# EAGLE design RatDBS-Plastic2032Battery-WithRegulator (EAGLE 7.7.0)
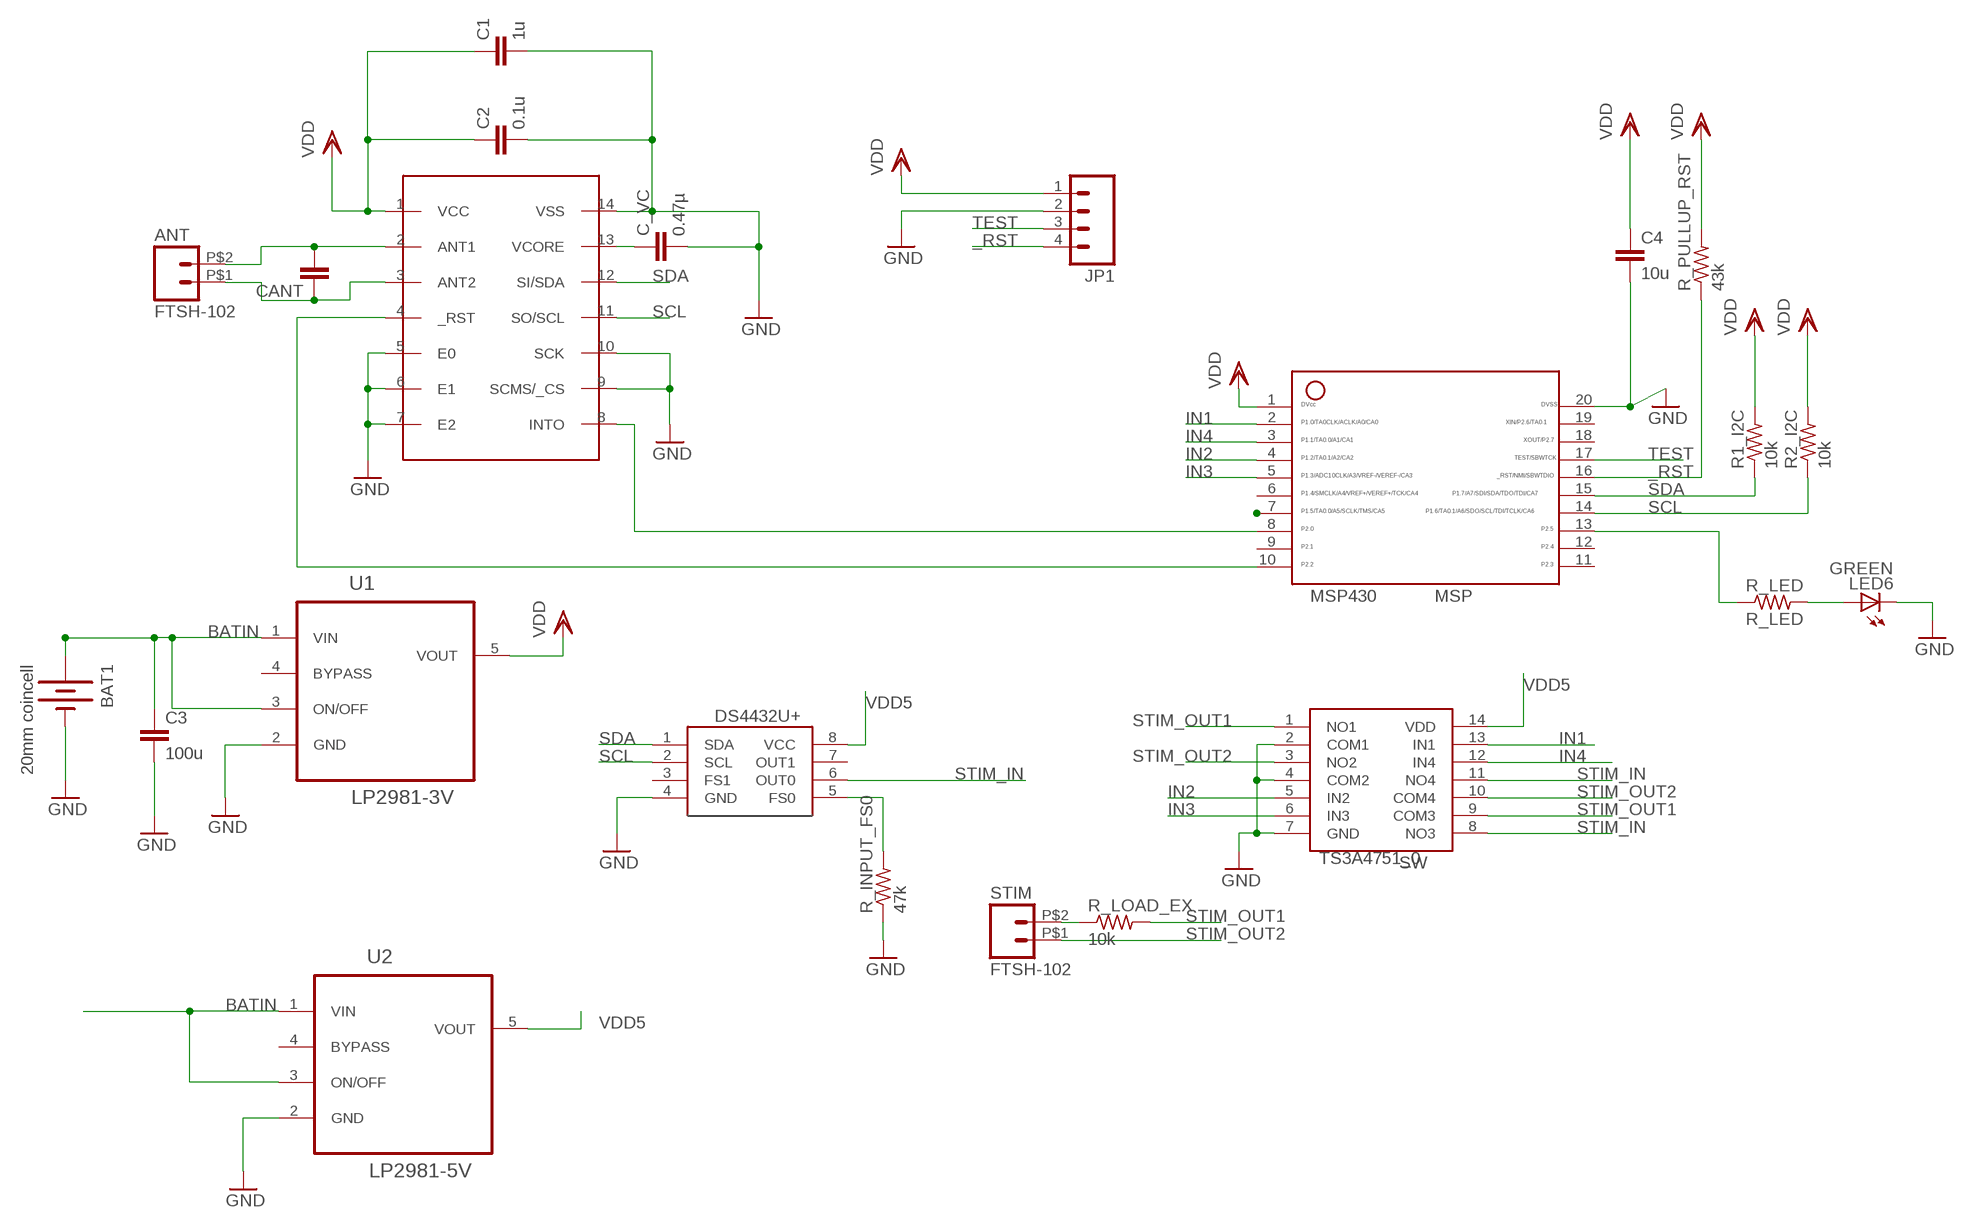
[diagram p0: schematic, sheet 1]

## Parts
ANT  FTSH-102  [FTSH-102-DH]
BAT1  20mm coincell  BATTERY  [BATTCOM_20MM_PLASTIC_STUDS]
C1  1u  C-EUC0603  [C0603]
C2  0.1u  C-EUC0603  [C0603]
C3  100u  C-EUC1206  [C1206]
C4  10u  C-EUC1206  [C1206]
C_VC  0.47µ  C-EUC0603  [C0603]
CANT  C-EUC0603  [C0603]
DS4432U+  DS4432U+  [8_PIN]
JP1  M041.27MM  [1X04-1.27MM]
LED6  GREEN  LED1206  [LED-1206]
MSP430  MSP  MSP430  [20_PIN]
R1_I2C  10k  R-US_R0603  [R0603]
R2_I2C  10k  R-US_R0603  [R0603]
R_INPUT_FS0  47k  R-US_R0603  [R0603]
R_LED  R_LED  R-US_R0603  [R0603]
R_LOAD_EX  10k  R-US_R0603  [R0603]
R_PULLUP_RST  43k  R-US_R0603  [R0603]
STIM  FTSH-102  [FTSH-102-DH]
TS3A4751_0  SW  TS3A4751  [14_PIN]
U1  LP2981-3V  LP2985A-33DBVTE4  [SOT95P280X145-5N]
U2  LP2981-5V  LP2985A-33DBVTE4  [SOT95P280X145-5N]
U$1  RF  RF430CL330H  [PW_R-PDSO-G14]

## Nets
_RST: JP1.4 MSP430.16 R_PULLUP_RST.1
BATIN: BAT1.1(+) C3.1 U1.1(VIN) U1.3(ON/OFF) U2.1(VIN) U2.3(ON/OFF)
GND: BAT1.2(-) C1.2 C2.2 C3.2 C4.2 C_VC.2 DS4432U+.4(GND) JP1.2 LED6.C MSP430.20 R_INPUT_FS0.1 TS3A4751_0.2(COM1) TS3A4751_0.4(COM2) TS3A4751_0.7(GND) U1.2(GND) U2.2(GND) U$1.5(E0) U$1.6(E1) U$1.7(E2) U$1.9(SCMS/_CS) U$1.10(SCK) U$1.14(VSS)
IN1: MSP430.2 TS3A4751_0.13(IN1)
IN2: MSP430.4 TS3A4751_0.5(IN2)
IN3: MSP430.5 TS3A4751_0.6(IN3)
IN4: MSP430.3 TS3A4751_0.12(IN4)
N$1: C_VC.1 U$1.13(VCORE)
N$2: ANT.P$2 CANT.2 U$1.2(ANT1)
N$3: MSP430.8 U$1.8(INTO)
N$4: R_LOAD_EX.1 STIM.P$2
N$5: MSP430.13 R_LED.1
N$6: MSP430.7
N$7: MSP430.10 U$1.4(_RST)
N$8: DS4432U+.5(FS0) R_INPUT_FS0.2
N$9: LED6.A R_LED.2
N$12: ANT.P$1 CANT.1 U$1.3(ANT2)
SCL: DS4432U+.2(SCL) MSP430.14 R2_I2C.1 U$1.11(SO/SCL)
SDA: DS4432U+.1(SDA) MSP430.15 R1_I2C.1 U$1.12(SI/SDA)
STIM_IN: DS4432U+.6(OUT0) TS3A4751_0.8(NO3) TS3A4751_0.11(NO4)
STIM_OUT1: R_LOAD_EX.2 TS3A4751_0.1(NO1) TS3A4751_0.9(COM3)
STIM_OUT2: STIM.P$1 TS3A4751_0.3(NO2) TS3A4751_0.10(COM4)
TEST: JP1.3 MSP430.17
VDD: C1.1 C2.1 C4.1 JP1.1 MSP430.1 R1_I2C.2 R2_I2C.2 R_PULLUP_RST.2 U1.5(VOUT) U$1.1(VCC)
VDD5: DS4432U+.8(VCC) TS3A4751_0.14(VDD) U2.5(VOUT)
Unconnected: DS4432U+.3(FS1) DS4432U+.7(OUT1) MSP430.6 MSP430.9 MSP430.11 MSP430.12 MSP430.18 MSP430.19 U1.4(BYPASS) U2.4(BYPASS)

## Library data of the parts
ANT STIM = Samtec50Mil:FTSH-102
BAT1 = Battery:BATTERY: Compact CR2032 Battery Holder SMT ground pad 20MM_4LEGS, Digikey: BAT-HLD-001-THM-OTL
C1-C4 C_VC CANT = rcl:C-EU: CAPACITOR, European symbol
DS4432U+ = RatDBS:DS4432U+: DS4432U+ current DAC
JP1 = SparkFun:M04: Header 4 Standard 4-pin 0.1" header. Use with straight break away headers (SKU : PRT-00116), right angle break away headers (PRT-00553), swiss pins (PRT-00743), machine pins (PRT-00117), and female headers (PRT-00115). Molex polarized connector foot print use with SKU : PRT-08231 with associated crimp pins and housings.
LED6 = SparkFun-LED:LED: LEDs Standard schematic elements and footprints for 5mm, 3mm, 1206, and 0603 sized LEDs. 5mm - Spark Fun Electronics SKU : COM-00529 (and others)
MSP430 = RatDBS:MSP430: MSP430 20 pins
R1_I2C R2_I2C R_INPUT_FS0 R_LED R_LOAD_EX R_PULLUP_RST = BiphasicBoard:R-US_: RESISTOR, American symbol
TS3A4751_0 = BiphasicBoard:TS3A4751: TS3A4751 Quad Switch
U1 U2 = Texas Instruments_By_element14_Batch_1:LP2985A-33DBVTE4: 150-mA LOW-NOISE LOW-DROPOUT REGULATOR WITH SHUTDOWN; MPN: LP2985A-33DBVTE4; OC_FARNELL: 1053660; OC_NEWARK: 79K3928; PACKAGE: SOT-23-5; SUPPLIER: Texas Instruments
U$1 = RF430CL330H:RF430CL330H

## Board
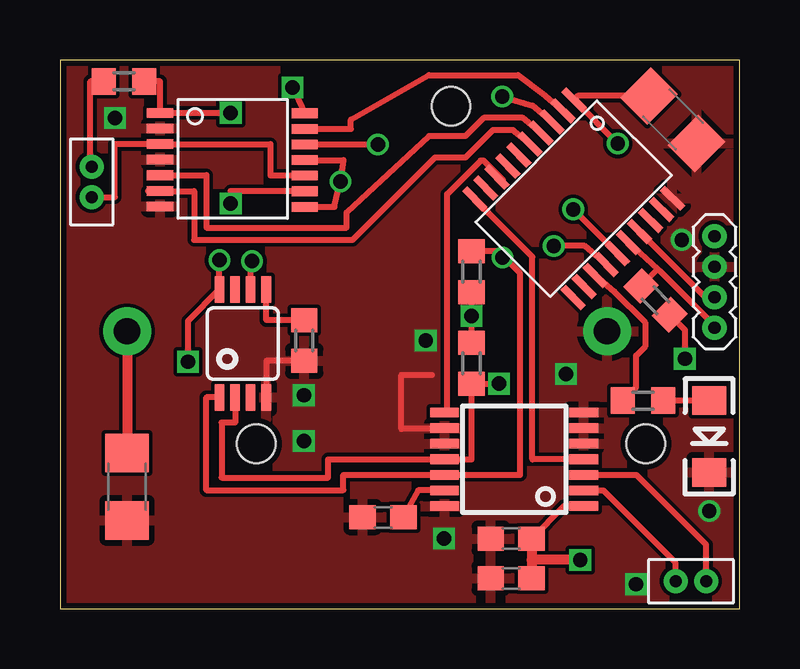
[diagram p1: board, top side]
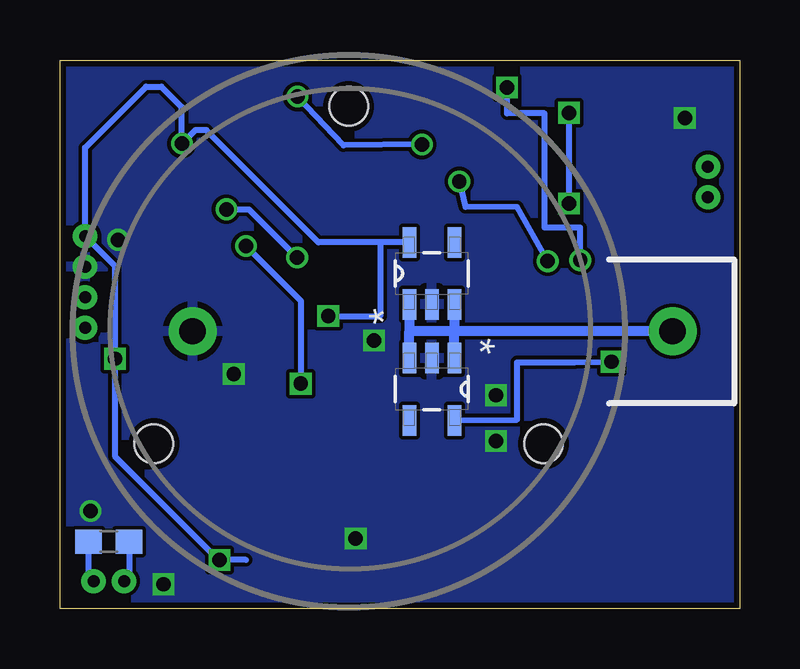
[diagram p2: board, bottom side, seen from below]

Size 28.32 x 22.86 mm. Coordinates in mm from the lower left corner, seen from the top.
Outline: 0,22.86 0,0 28.32,0 28.32,22.86 0,22.86
Copper layers (1*16): Top 0.035mm / dielectric 1.5mm / Bottom 0.035mm
Design rules "Seeed_DRU": minimum track width 6mil, minimum drill 12mil, track to track 6mil, track to pad 6mil, pad to pad 6mil, via to via 6mil, smd to smd 0mil, copper to edge 10mil, drill to drill 10mil, minimum pad ring 10mil, minimum via ring 6mil, stop-mask expansion 2mil, vias tented up to drill 100mil, thermal gap 10mil

### Footprints (pad centres in the part's own frame; a part is rotated, then mirrored left to right if it is on the bottom)
FTSH-102-DH = drill 0.5 pad 1: P$1 -0.635,0; P$2 0.635,0
BATTCOM_20MM_PLASTIC_STUDS = drill 1.1 pad 2: 1 13.5,0; 2 -6.5,0 | hole 1.6: 0,9.37; -8.115,-4.685; 8.115,-4.685
C0603 = smd 1.1 x 1: 1 -0.85,0; 2 0.85,0
C1206 = smd 1.6 x 1.8: 1 -1.4,0; 2 1.4,0
8_PIN = smd 1.1 x 0.4: 1 -2.25,0.975; 2 -2.25,0.325; 3 -2.25,-0.325; 4 -2.25,-0.975; 5 2.25,-0.975; 6 2.25,-0.325; 7 2.25,0.325; 8 2.25,0.975
1X04-1.27MM = drill 0.508 pad 1: 1 0,0; 2 1.27,0; 3 2.54,0; 4 3.81,0
LED-1206 = smd 1.2 x 1.4: A -1.5,0; C 1.5,0
20_PIN = smd 0.3 x 1.2: 1 -2.925,-2.9; 2 -2.275,-2.9; 3 -1.625,-2.9; 4 -0.975,-2.9; 5 -0.325,-2.9; 6 0.325,-2.9; 7 0.975,-2.9; 8 1.625,-2.9; 9 2.275,-2.9; 10 2.925,-2.9; 11 2.925,2.9; 12 2.275,2.9; 13 1.625,2.9; 14 0.975,2.9; 15 0.325,2.9; 16 -0.325,2.9; 17 -0.975,2.9; 18 -1.625,2.9; 19 -2.275,2.9; 20 -2.925,2.9
R0603 = smd 1 x 1.1: 1 -0.85,0; 2 0.85,0
14_PIN = smd 1.1 x 0.4: 1 -3.26,1.165; 2 -3.26,0.515; 3 -3.26,-0.135; 4 -3.26,-0.785; 5 -3.26,-1.435; 6 -3.26,-2.085; 7 -3.26,-2.735; 8 2.77,-2.755; 9 2.77,-2.105; 10 2.77,-1.455; 11 2.77,-0.805; 12 2.77,-0.155; 13 2.77,0.495; 14 2.77,1.145
SOT95P280X145-5N = smd 1.27 x 0.559: 1 -1.295,0.94; 2 -1.295,0; 3 -1.295,-0.94; 4 1.295,-0.94; 5 1.295,0.94
PW_R-PDSO-G14 = smd 0.4 x 1.2: 1 -1.95,-2.9; 2 -1.3,-2.9; 3 -0.65,-2.9; 4 0,-2.9; 5 0.65,-2.9; 6 1.3,-2.9; 7 1.95,-2.9; 8 1.95,2.9; 9 1.3,2.9; 10 0.65,2.9; 11 0,2.9; 12 -0.65,2.9; 13 -1.3,2.9; 14 -1.95,2.9

### Placement (x,y rotation side)
ANT  26.29,1.14 180 top
BAT1  16.29,11.56 0 bottom
C1  18.8,2.92 180 top
C2  18.8,1.27 180 top
C3  2.79,5.08 270 top
C4  25.54,20.37 315 top
C_VC  13.46,3.81 180 top
CANT  26.29,2.79 0 bottom
DS4432U+  7.62,11.05 90 top
JP1  27.27,15.52 270 top
LED6  27.05,7.18 270 top
MSP430  21.4,17.08 225 top
R1_I2C  17.14,14.03 270 top
R2_I2C  17.14,10.22 90 top
R_INPUT_FS0  10.18,11.18 90 top
R_LED  24.3,8.67 0 top
R_LOAD_EX  2.67,21.97 0 top
R_PULLUP_RST  24.81,12.84 315 top
STIM  1.32,17.78 90 top
TS3A4751_0  7.43,19.49 0 top
U1  12.83,13.97 90 bottom
U2  12.83,9.14 270 bottom
U$1  18.92,6.22 90 top

### Tracks (layer width: path | path; a pad name or v marks a point on that pad's centre or on a via)
_RST
  Top 0.254: MSP430.16 24.91,14.15 | 24.91,14.15 25.04,14.03 27.27,11.79 JP1.4 | R_PULLUP_RST.1 24.91,14.14 24.91,14.15
BATIN
  Top 0.406: BAT1.1 C3.1
  Bottom 0.406: BAT1.1 11.89,11.56 | 11.89,11.56 13.77,11.56 | U1.1 13.77,11.56 | U2.3 13.77,11.56 | U1.3 11.89,11.56 | U2.1 11.89,11.56
GND  (via drill 0.6)
  Top 0.254: R_INPUT_FS0.1 8.6,10.33 DS4432U+.4 | U$1.9 16.02,7.49 14.22,7.49 14.22,9.74 15.49,9.74
  other vias: 21.08,9.78 10.16,8.89 16,2.92 15.24,11.18 2.29,20.45 10.16,6.99 25.91,15.37 27.05,4.06 24,1.02
  pour Top: 0,0 0,22.86 29.46,22.86 29.46,0
  pour Bottom: 0,0 0,22.86 29.46,22.86 29.46,0
IN1
  Top 0.254: MSP430.2 20.11,21.46 19.09,22.23 15.37,22.23 12.12,20.37 12.12,19.99 TS3A4751_0.13
IN2
  Top 0.254: TS3A4751_0.5 6.1,18.06 6.1,15.88 11.94,15.88 11.94,16.51 15.37,19.68 16.89,19.68 17.65,20.45 19.29,20.45 MSP430.4
IN3
  Top 0.254: TS3A4751_0.6 3.66,17.4 5.59,17.4 5.59,15.37 12.19,15.37 15.62,18.8 16.89,18.8 18.03,19.94 18.88,19.94 MSP430.5
IN4  (via drill 0.6)
  Top 0.254: MSP430.3 19.7,20.95 v18.43,21.34 | TS3A4751_0.12 v13.24,19.34
  Bottom 0.254: v13.24,19.34 16.51,19.3 v18.43,21.34
N$1
  Top 0.254: U$1.13 14.92,4.92 C_VC.1
N$2
  Top 0.254: ANT.P$2 25.65,1.91 22.64,4.92 U$1.2
  Bottom 0.254: CANT.2 25.44,1.36 ANT.P$2
N$3
  Top 0.254: U$1.8 16.13,8.17 16.13,17.27 17.53,18.67 17.65,18.67 18.45,17.87 MSP430.8
N$4
  Top 0.254: STIM.P$2 1.27,18.41 1.27,21.97 R_LOAD_EX.1
N$5
  Top 0.254: MSP430.13 23.1,13.21 24.38,11.93 24.38,10.92 24,10.54 24,9.22 R_LED.1
N$7
  Top 0.254: U$1.4 19.68,6.22 19.68,14.66 MSP430.10
N$8
  Top 0.254: R_INPUT_FS0.2 8.6,12.03 DS4432U+.5
N$9
  Top 0.254: LED6.A 27.04,8.66 R_LED.2
N$12
  Top 0.254: ANT.P$1 26.92,2.67 24.02,5.57 U$1.3
  Bottom 0.254: CANT.1 27.14,1.36 ANT.P$1
SCL  (via drill 0.6)
  Top 0.254: DS4432U+.2 7.29,7.75 6.73,7.75 6.73,5.46 11.18,5.46 11.18,6.22 U$1.11 17.14,6.22 R2_I2C.1 v18.29,9.37 | MSP430.14 21.86,15.11 v20.57,15.11
  Bottom 0.254: v20.57,15.11 18.29,12.83 v18.29,9.37
SDA  (via drill 0.6)
  Top 0.254: DS4432U+.1 6.1,8.8 6.1,4.94 11.81,4.94 11.81,5.57 U$1.12 19.18,5.57 19.18,13.97 18.26,14.88 | 18.26,14.88 R1_I2C.1 | 18.26,14.88 v18.44,14.63 | MSP430.15 v21.38,16.64
  Bottom 0.254: v21.38,16.64 20.45,16.64 v18.44,14.63
STIM_IN  (via drill 0.6)
  Top 0.254: TS3A4751_0.11 11.81,18.69 v11.68,17.8 11.43,16.74 TS3A4751_0.8 | DS4432U+.6 7.95,14.35 v8,14.48
  Bottom 0.254: v11.68,17.8 11.43,16.74 9.27,16.73 v8,14.48
STIM_OUT1  (via drill 0.6)
  Top 0.254: TS3A4751_0.9 7.11,17.4 v7.11,16.88 | v7.11,20.66 TS3A4751_0.1 4.17,21.97 R_LOAD_EX.2
  Bottom 0.254: v7.11,16.88 v7.11,20.66
STIM_OUT2
  Top 0.254: TS3A4751_0.10 8.76,18.04 8.76,19.36 TS3A4751_0.3 2.29,19.36 2.29,17.14 STIM.P$1
TEST
  Top 0.254: MSP430.17 26.88,12.98 JP1.3
VDD  (via drill 0.6)
  Top 0.254: R1_I2C.2 v17.14,12.19 R2_I2C.2 | R_PULLUP_RST.2 26.04,11.62 v26.04,10.41 | v23.24,19.38 MSP430.1 21.58,21.36 C4.1 | U$1.1 21,4.27 C1.1
  Top 0.406: 19.68,2.92 C1.1 19.65,2.03 | 19.65,2.03 C2.1 | v21.68,2.03 19.65,2.03
  Bottom 0.254: U1.5 14.99,15.27 | 14.99,15.27 14.99,12.19 v17.14,12.19 | 14.99,15.27 17.55,15.27 22.23,19.94 22.68,19.94 v23.24,19.38 23.24,20.9 24.09,21.75 24.73,21.75 27.27,19.21 JP1.1 26.04,14.28 v26.04,10.41 26.04,6.35 21.72,2.03 v21.68,2.03 20.57,2.03
VDD5  (via drill 0.6)
  Top 0.254: v5.33,10.29 5.33,11.99 DS4432U+.8 v6.64,14.52 | TS3A4751_0.14 v9.69,21.72 9.78,21.72
  Bottom 0.254: U2.5 9.27,7.87 9.27,10.26 6.88,10.26 v5.33,10.29 | v6.64,14.52 6.64,15.88 8.13,15.88 8.13,20.64 9.69,20.64 v9.69,21.72

### Text on the board
bValues: RTGV
tDocu: STIM
bDocu: NFC-RDBS v2.1 / Kemere Lab / (C)2017